# Altium schematic sheet MEA_60_6MIL.SchDoc
size A3; DocumentNumber: 1; SheetNumber: 1; SheetTotal: 1
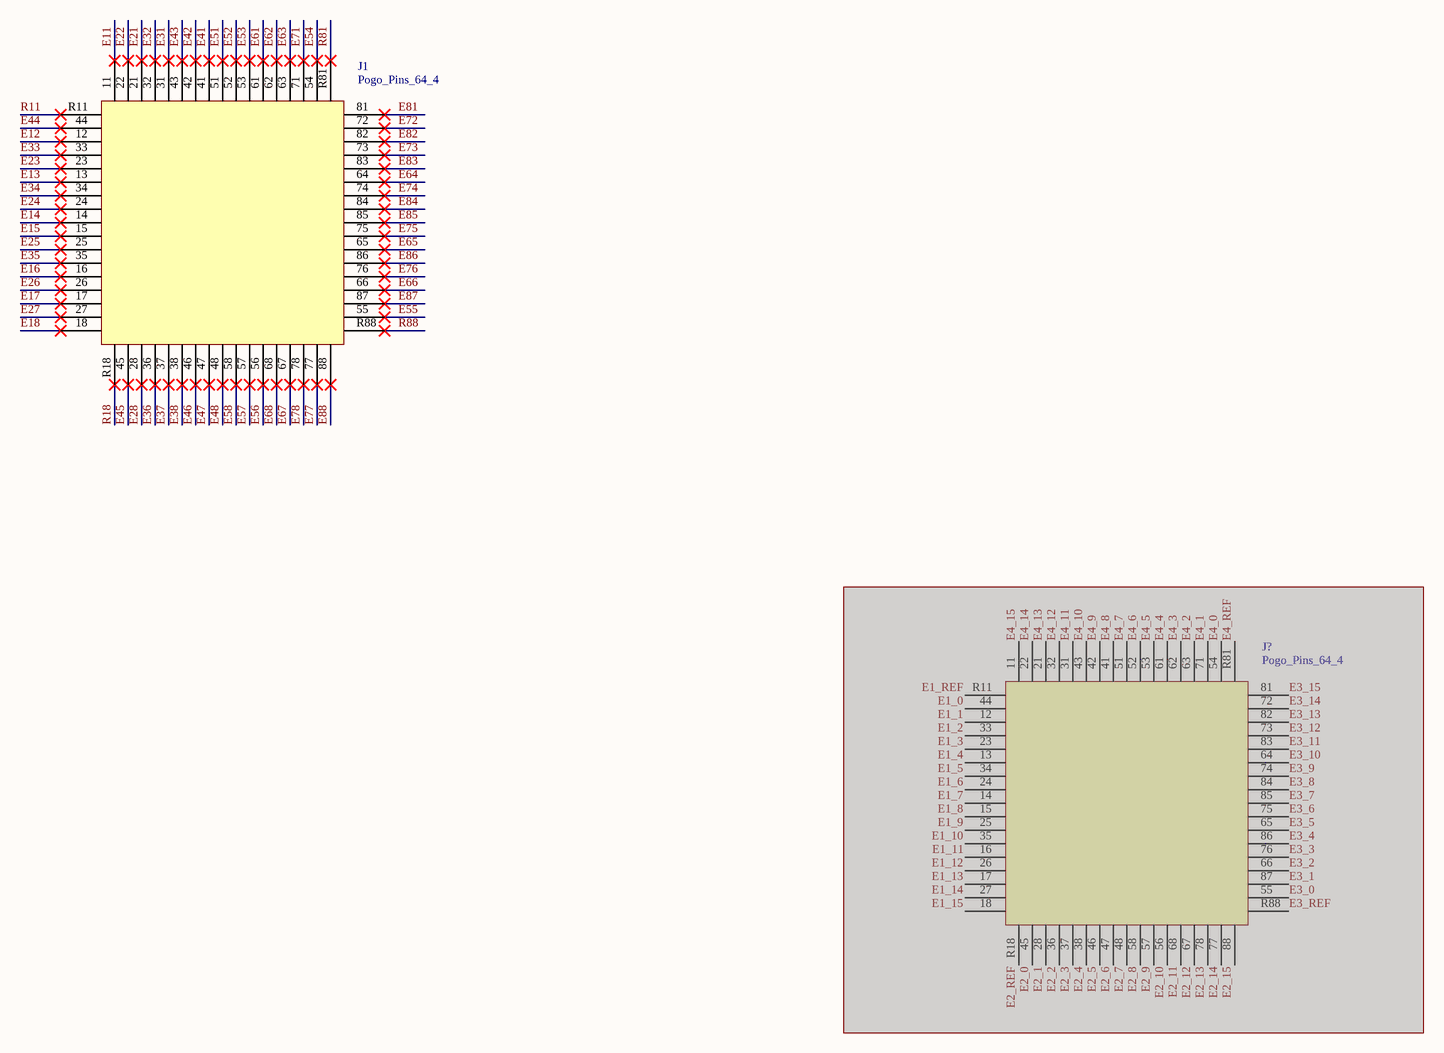
[diagram p0: MEA_60_6MIL.SchDoc]

## Parts
J1  Pogo_Pins_64_4  [Pogo_Pins_64_4]
J?  Pogo_Pins_64_4  [Pogo_Pins_64_4]  (masked out: inside a compile mask, not in the netlist)

## Nets
E11: J1.11
E12: J1.12
E13: J1.13
E14: J1.14
E15: J1.15
E16: J1.16
E17: J1.17
E18: J1.18
E21: J1.21
E22: J1.22
E23: J1.23
E24: J1.24
E25: J1.25
E26: J1.26
E27: J1.27
E28: J1.28
E31: J1.31
E32: J1.32
E33: J1.33
E34: J1.34
E35: J1.35
E36: J1.36
E37: J1.37
E38: J1.38
E41: J1.41
E42: J1.42
E43: J1.43
E44: J1.44
E45: J1.45
E46: J1.46
E47: J1.47
E48: J1.48
E51: J1.51
E52: J1.52
E53: J1.53
E54: J1.54
E55: J1.55
E56: J1.56
E57: J1.57
E58: J1.58
E61: J1.61
E62: J1.62
E63: J1.63
E64: J1.64
E65: J1.65
E66: J1.66
E67: J1.67
E68: J1.68
E71: J1.71
E72: J1.72
E73: J1.73
E74: J1.74
E75: J1.75
E76: J1.76
E77: J1.77
E78: J1.78
E81: J1.81
E82: J1.82
E83: J1.83
E84: J1.84
E85: J1.85
E86: J1.86
E87: J1.87
E88: J1.88
R11: J1.R11
R18: J1.R18
R81: J1.R81
R88: J1.R88

## Library data of the parts
J1 J? = Pogo_Pins_64_4: Pogo pins, 64 recording electrodes, 4 reference electrodes